# EAGLE design nanonode-xmega (EAGLE 5.10)
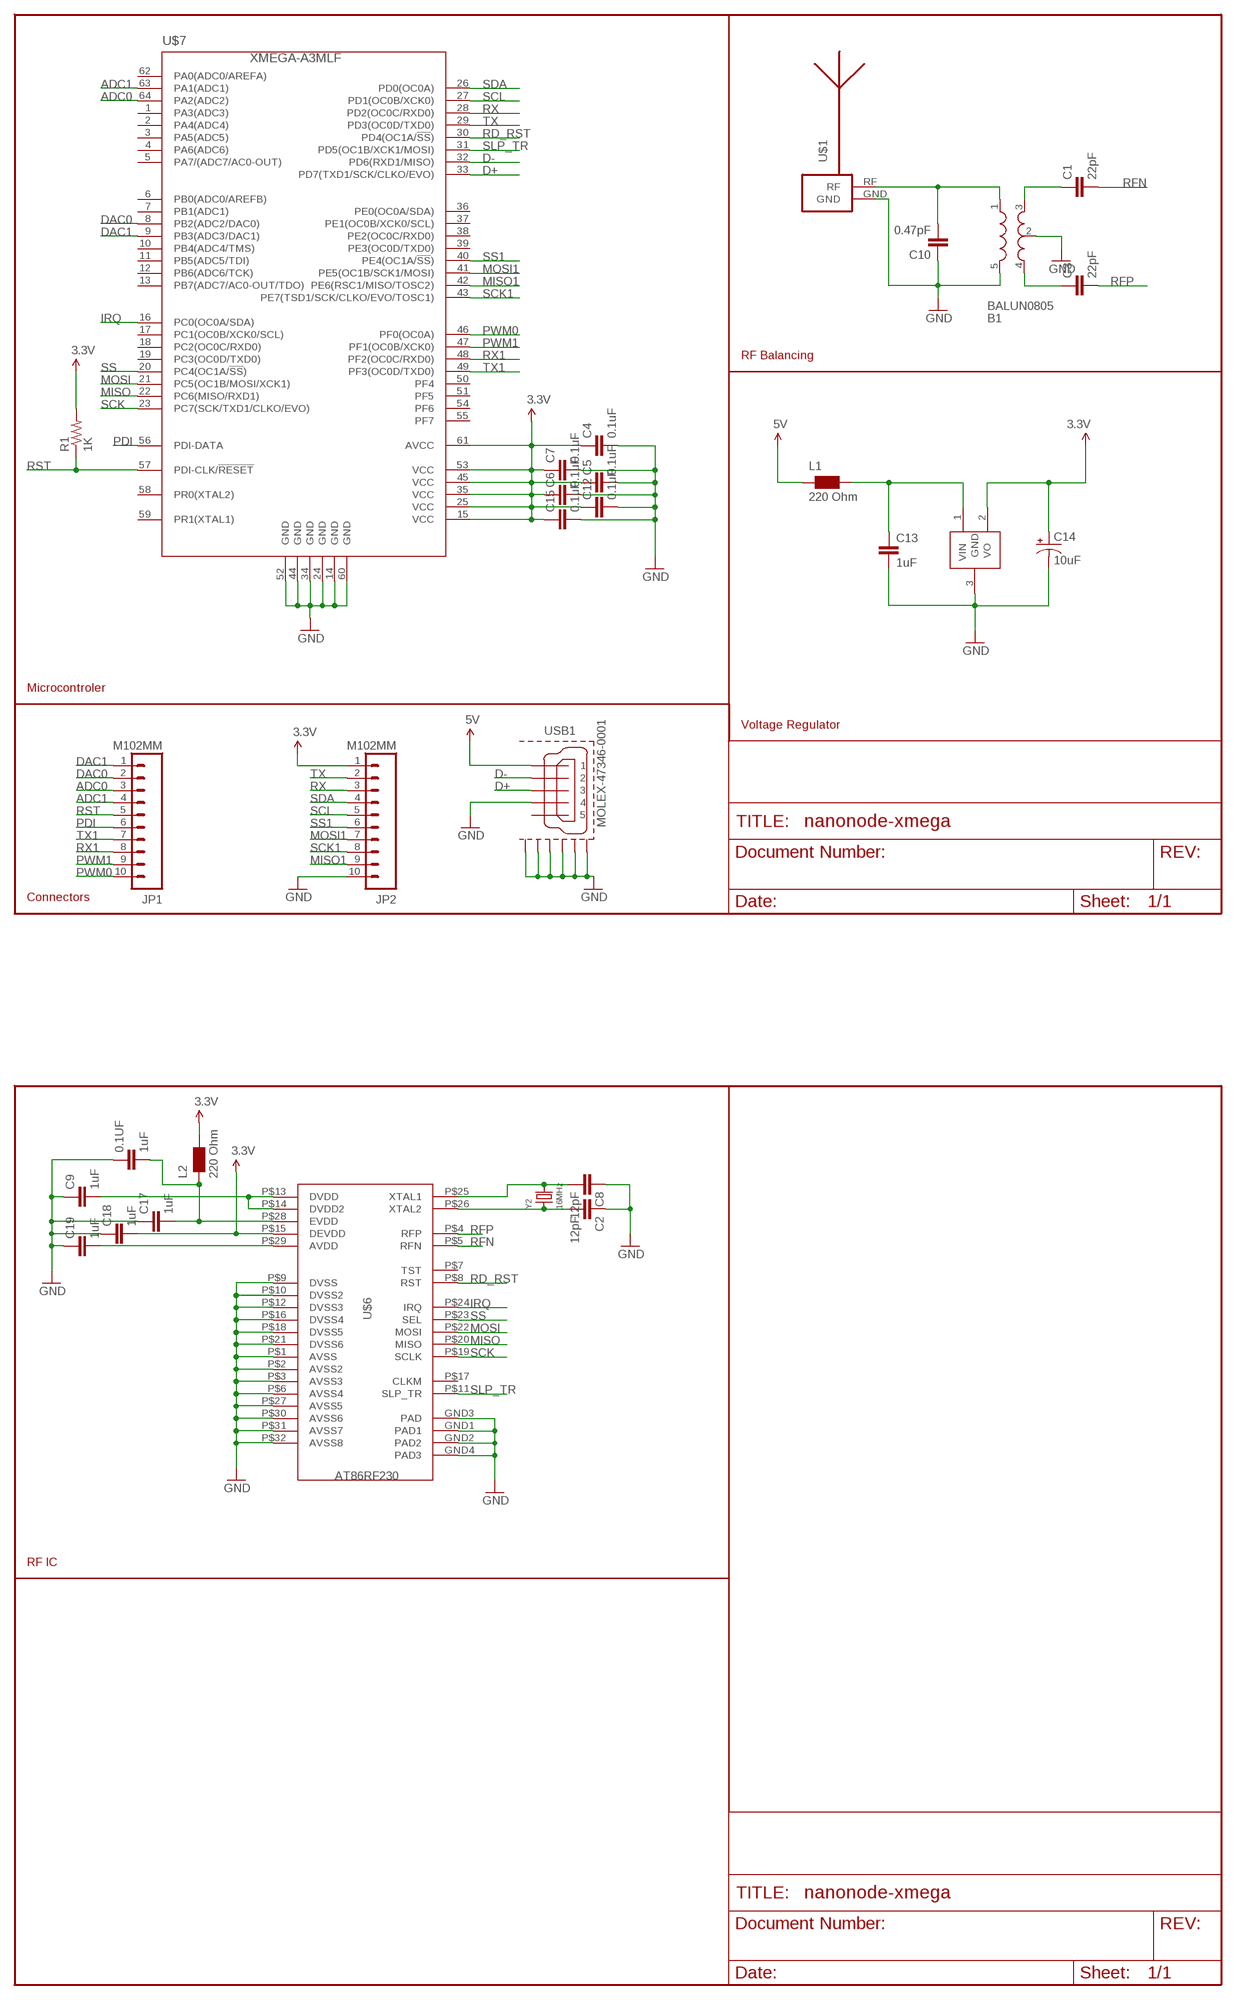
[diagram p0: schematic, sheet 1]

## Parts
0.1UF  1uF  C-EUC0603  [C0603]
B1  BALUN0805  [BALUN]
C1  22pF  C-EUC0603  [C0603]
C2  12pF  C-EUC0603  [C0603]
C3  22pF  C-EUC0603  [C0603]
C4  0.1uF  C-EUC0603  [C0603]
C5  0.1uF  C-EUC0603  [C0603]
C6  0.1uF  C-EUC0603  [C0603]
C7  0.1uF  C-EUC0603  [C0603]
C8  12pF  C-EUC0603  [C0603]
C9  1uF  C-EUC0603  [C0603]
C10  0.47pF  C-EUC0603  [C0603]
C12  0.1uF  C-EUC0603  [C0603]
C13  1uF  C-EUC0603  [C0603]
C14  10uF  CAP_POL1206  [EIA3216]
C15  0.1uF  C-EUC0603  [C0603]
C17  1uF  C-EUC0603  [C0603]
C18  1uF  C-EUC0603  [C0603]
C19  1uF  C-EUC0603  [C0603]
JP1  M102MM  [1X10-2MM]
JP2  M102MM  [1X10-2MM]
L1  220 Ohm  WE-CBF_0603  [0603]
L2  220 Ohm  WE-CBF_0603  [0603]
R1  1K  R-US_R0402  [R0402]
U$1  ANTENNA_1LEFT  [SWRA117D_LEFT]
U$4  MCP1700  [SOT23-3]
U$6  AT86RF230  [QFN-32]
U$7  XMEGA-A3MLF  [MLF64]
USB1  MOLEX-47346-0001  [MOLEX-47364-0001]
Y2  16MHz  CRYSTALTHIN  [CRYSTAL_3.2X2.5]

## Nets
3.3V: C4.1 C5.1 C6.1 C7.1 C12.1 C14.A(+) C15.1 C18.2 JP2.1 L2.2 R1.2 U$4.2(VO) U$6.P$15(DEVDD) U$7.15(VCC) U$7.25(VCC) U$7.35(VCC) U$7.45(VCC) U$7.53(VCC) U$7.61(AVCC)
5V: L1.1 USB1.1
ADC0: JP1.3 U$7.64(PA2(ADC2))
ADC1: JP1.4 U$7.63(PA1(ADC1))
D+: U$7.33(PD7(TXD1/SCK/CLKO/EVO)) USB1.3
D-: U$7.32(PD6(RXD1/MISO)) USB1.2
DAC0: JP1.2 U$7.8(PB2(ADC2/DAC0))
DAC1: JP1.1 U$7.9(PB3(ADC3/DAC1))
GND: 0.1UF.1 B1.2(GND) B1.5(GND) C2.1 C4.2 C5.2 C6.2 C7.2 C8.1 C9.1 C10.1 C12.2 C13.2 C14.C(-) C15.2 C17.1 C18.1 C19.1 JP2.10 U$1.GND U$4.3(GND) U$6.GND1(PAD1) U$6.GND2(PAD2) U$6.GND3(PAD) U$6.GND4(PAD3) U$6.P$1(AVSS) U$6.P$2(AVSS2) U$6.P$3(AVSS3) U$6.P$6(AVSS4) U$6.P$9(DVSS) U$6.P$10(DVSS2) U$6.P$12(DVSS3) U$6.P$16(DVSS4) U$6.P$18(DVSS5) U$6.P$21(DVSS6) U$6.P$27(AVSS5) U$6.P$30(AVSS6) U$6.P$31(AVSS7) U$6.P$32(AVSS8) U$7.14(GND) U$7.24(GND) U$7.34(GND) U$7.44(GND) U$7.52(GND) U$7.60(GND) USB1.4 USB1.GND1 USB1.GND2 USB1.GND3 USB1.GND4 USB1.GND5 USB1.GND6
IRQ: U$6.P$24(IRQ) U$7.16(PC0(OC0A/SDA))
MISO: U$6.P$20(MISO) U$7.22(PC6(MISO/RXD1))
MISO1: JP2.9 U$7.42(PE6(RSC1/MISO/TOSC2))
MOSI: U$6.P$22(MOSI) U$7.21(PC5(OC1B/MOSI/XCK1))
MOSI1: JP2.7 U$7.41(PE5(OC1B/SCK1/MOSI))
N$1: B1.3(OUT1) C1.1
N$2: B1.4(OUT2) C3.1
N$3: C2.2 U$6.P$26(XTAL2) Y2.1
N$4: C8.2 U$6.P$25(XTAL1) Y2.2
N$6: C9.2 U$6.P$13(DVDD) U$6.P$14(DVDD2)
N$8: C19.2 U$6.P$29(AVDD)
N$10: B1.1(IN) C10.2 U$1.RF
N$13: C13.1 L1.2 U$4.1(VIN)
N$15: 0.1UF.2 C17.2 L2.1 U$6.P$28(EVDD)
PDI: JP1.6 U$7.56(PDI-DATA)
PWM0: JP1.10 U$7.46(PF0(OC0A))
PWM1: JP1.9 U$7.47(PF1(OC0B/XCK0))
RD_RST: U$6.P$8(RST) U$7.30(PD4(OC1A/!SS!))
RFN: C1.2 U$6.P$5(RFN)
RFP: C3.2 U$6.P$4(RFP)
RST: JP1.5 R1.1 U$7.57(PDI-CLK/!RESET)
RX: JP2.3 U$7.28(PD2(OC0C/RXD0))
RX1: JP1.8 U$7.48(PF2(OC0C/RXD0))
SCK: U$6.P$19(SCLK) U$7.23(PC7(SCK/TXD1/CLKO/EVO))
SCK1: JP2.8 U$7.43(PE7(TSD1/SCK/CLKO/EVO/TOSC1))
SCL: JP2.5 U$7.27(PD1(OC0B/XCK0))
SDA: JP2.4 U$7.26(PD0(OC0A))
SLP_TR: U$6.P$11(SLP_TR) U$7.31(PD5(OC1B/XCK1/MOSI))
SS: U$6.P$23(SEL) U$7.20(PC4(OC1A/!SS!))
SS1: JP2.6 U$7.40(PE4(OC1A/!SS!))
TX: JP2.2 U$7.29(PD3(OC0D/TXD0))
TX1: JP1.7 U$7.49(PF3(OC0D/TXD0))
Unconnected: U$6.P$7(TST) U$6.P$17(CLKM) U$7.1(PA3(ADC3)) U$7.2(PA4(ADC4)) U$7.3(PA5(ADC5)) U$7.4(PA6(ADC6)) U$7.5(PA7/(ADC7/AC0-OUT)) U$7.6(PB0(ADC0/AREFB)) U$7.7(PB1(ADC1)) U$7.10(PB4(ADC4/TMS)) U$7.11(PB5(ADC5/TDI)) U$7.12(PB6(ADC6/TCK)) U$7.13(PB7(ADC7/AC0-OUT/TDO)) U$7.17(PC1(OC0B/XCK0/SCL)) U$7.18(PC2(OC0C/RXD0)) U$7.19(PC3(OC0D/TXD0)) U$7.36(PE0(OC0A/SDA)) U$7.37(PE1(OC0B/XCK0/SCL)) U$7.38(PE2(OC0C/RXD0)) U$7.39(PE3(OC0D/TXD0)) U$7.50(PF4) U$7.51(PF5) U$7.54(PF6) U$7.55(PF7) U$7.58(PR0(XTAL2)) U$7.59(PR1(XTAL1)) U$7.62(PA0(ADC0/AREFA)) USB1.5

## Notes on the sheet
- RF Balancing
- Microcontroler
- Voltage Regulator
- Connectors
- RF IC

## Library data of the parts
0.1UF C1-C10 C12 C13 C15 C17-C19 = rcl:C-EU: CAPACITOR, European symbol
B1 = custom:BALUN
C14 = sparkfun:CAP_POL: Capacitor Polarized These are standard SMD and PTH capacitors. Normally 10uF, 47uF, and 100uF in electrolytic and tantalum varieties. Always verify the external diameter of the through hole cap, it varies with capacity, voltage, and manufacturer. The EIA devices should be standard.
JP1 JP2 = sparkfun:M10: Header 10 Standard 10-pin 0.1" header. Use with straight break away headers (SKU : PRT-00116), right angle break away headers (PRT-00553), swiss pins (PRT-00743), machine pins (PRT-00117), and female headers (PRT-00115).
L1 L2 = wuerth-elektronik:WE-CBF: SMD EMI Suppression Ferrite Beads - excellent anti-EMI properties - low DCR - impedances till 3000 ohms - rated current up to 6 A
R1 = resistor:R-US_: RESISTOR, American symbol
U$1 = ant-planar-1:ANTENNA_1
U$4 = nonolith:MCP1700: Voltage regulator
U$6 = custom:AT86RF230
U$7 = custom:XMEGA-A3: Atmel XMega A3 series processor
USB1 = custom:MOLEX-47346-0001: MICRO USB B, BOTTOM MOUNT
Y2 = nonolith:CRYSTAL: Crystals HC49UP - Surface Mount Crystal 4.0MHz 18pF +/-30ppm Surface Mount Crystal [Digikey: 535-9857-1-ND] 12.0 MHz Surface Mount Crystal [Digikey: 535-9869-6-ND] 25.0 MHz Surface Mount Crystal [Digikey: 535-9078-1-ND] 3.2 x 2.5mm - MEMs SMT Crystal 12.0 MHz 8pF 15ppm 3.2 x 2.5mm Crystal [Digikey: 644-1047-1-ND] 16.0 MHz 8pF 15ppm 3.2 x 2.5mm Crystal [Digikey: 644-1049-1-ND] 16.0 MHz 10pF 10ppm 3.2 x 2.5mm Crystal [Digikey: 644-1100-1-ND] 27.12 MHz 18pF 30ppm 3.2 x 2.5mm Crystal [Digikey: 887-1424-1-ND] 4.9 x 1.8mm - MEMs SMT Crystal 32.768 KHz 12.5pF 20ppm 4.9 x 1.8mm Crystal [Digikey: SE2415CT-ND] Cylinder 32.768KHz Cylinder Crystal

## Board
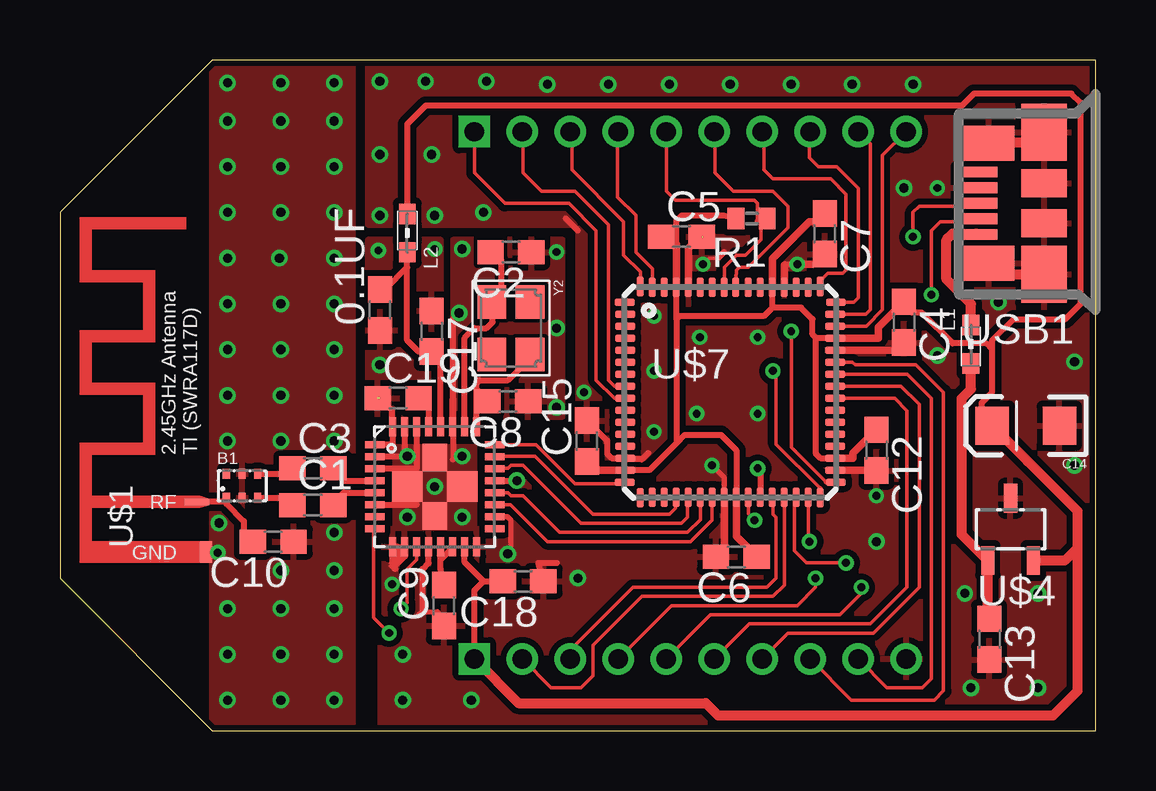
[diagram p1: board, top side]
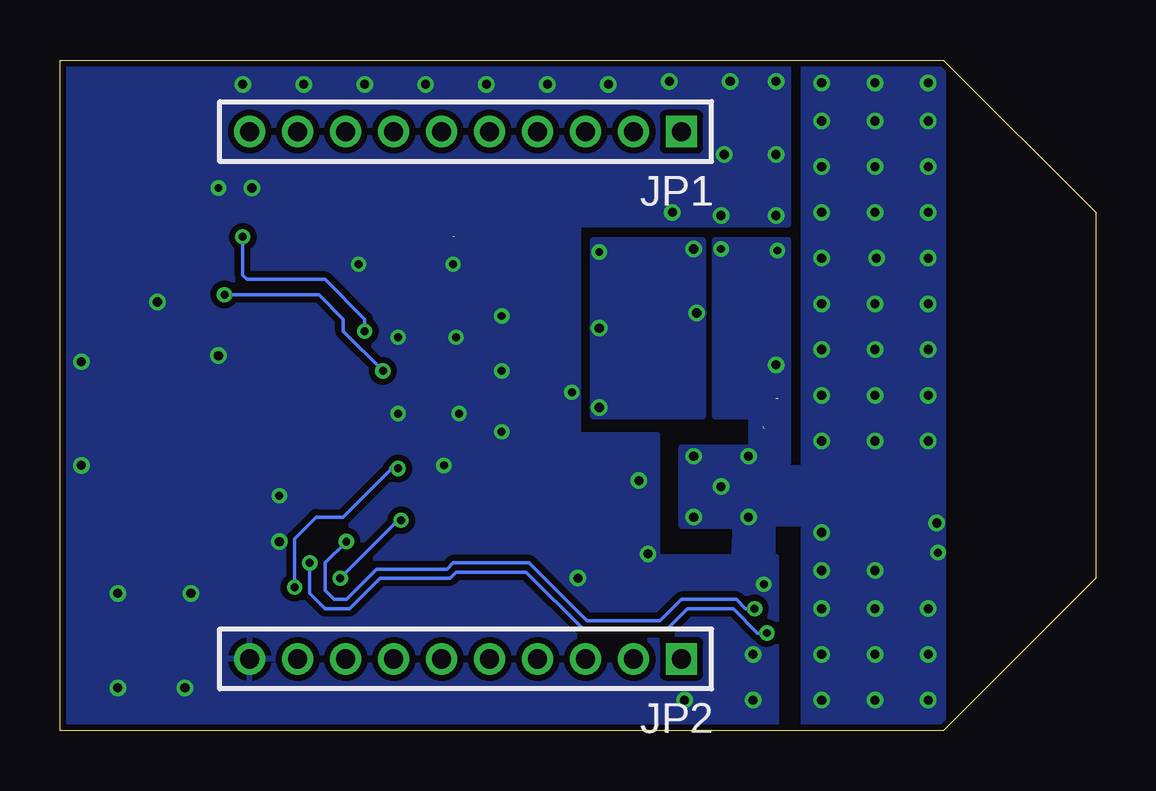
[diagram p2: board, bottom side, seen from below]

Size 43.18 x 27.94 mm. Coordinates in mm from the lower left corner, seen from the top.
Outline: 43.18,27.94 6.35,27.94 0,21.59 0,6.35 6.35,0 43.18,0 43.18,27.94
Copper layers (1*16): Top 0.035mm / dielectric 1.5mm / Bottom 0.035mm
Design rules "Fusion_eagle_rule_v1.1": minimum track width 6mil, minimum drill 12mil, track to track 6mil, track to pad 6mil, pad to pad 6mil, via to via 6mil, smd to smd 0mil, copper to edge 10mil, drill to drill 10mil, minimum pad ring 10mil, minimum via ring 6mil, stop-mask expansion 2mil, vias tented up to drill 100mil, thermal gap 10mil

### Footprints (pad centres in the part's own frame; a part is rotated, then mirrored left to right if it is on the bottom)
C0603 = smd 1.1 x 1: 1 -0.85,0; 2 0.85,0
BALUN = smd 0.3 x 0.4: 1 -0.7,-0.5; 2 -0.05,-0.5; 3 0.6,-0.5; 4 0.6,0.5; 5 -0.05,0.5; 6 -0.7,0.5
EIA3216 = smd 1.4 x 1.6: A 1.4,0; C -1.4,0
1X10-2MM = drill 0.8 square: 1 0,0 | drill 0.8 round: 2 2,0; 3 4,0; 4 6,0; 5 8,0; 6 10,0; 7 12,0; 8 14,0; 9 16,0; 10 18,0
0603 = smd 0.85 x 0.7: 1 -0.9,0; 2 0.7,0
R0402 = smd 0.7 x 0.9: 1 -0.65,0; 2 0.65,0
SWRA117D_LEFT = smd 0.9 x 0.508: GND 0.45,0.127 | smd 0.254 x 1.016: RF 2.54,0.51
SOT23-3 = smd 0.55 x 1.2: 1 0.95,1.3; 2 -0.95,1.3; 3 0,-1.3
QFN-32 = smd 1.27 x 1.27: GND1 0,1.143; GND3 0,-1.143 | smd 1.143 x 1.016: GND2 1.219,0; GND4 -1.219,0 | smd 0.285 x 0.8: P$1 -1.75,-2.5; P$2 -1.25,-2.5; P$3 -0.75,-2.5; P$4 -0.25,-2.5; P$5 0.25,-2.5; P$6 0.75,-2.5; P$7 1.25,-2.5; P$8 1.75,-2.5; P$17 1.75,2.5; P$18 1.25,2.5; P$19 0.75,2.5; P$20 0.25,2.5; P$21 -0.25,2.5; P$22 -0.75,2.5; P$23 -1.25,2.5; P$24 -1.75,2.5 | smd 0.8 x 0.285: P$9 2.5,-1.75; P$10 2.5,-1.25; P$11 2.5,-0.75; P$12 2.5,-0.25; P$13 2.5,0.25; P$14 2.5,0.75; P$15 2.5,1.25; P$16 2.5,1.75; P$25 -2.5,1.75; P$26 -2.5,1.25; P$27 -2.5,0.75; P$28 -2.5,0.25; P$29 -2.5,-0.25; P$30 -2.5,-0.75; P$31 -2.5,-1.25; P$32 -2.5,-1.75
MLF64 = smd 0.827 x 0.3: 1 -4.401,3.75; 2 -4.376,3.25; 3 -4.376,2.75; 4 -4.376,2.25; 5 -4.376,1.75; 6 -4.376,1.25; 7 -4.376,0.75; 8 -4.376,0.25; 9 -4.376,-0.25; 10 -4.376,-0.75; 11 -4.376,-1.25; 12 -4.376,-1.75; 13 -4.376,-2.25; 14 -4.376,-2.75; 15 -4.376,-3.25; 16 -4.401,-3.75; 33 4.401,-3.75; 34 4.376,-3.25; 35 4.376,-2.75; 36 4.376,-2.25; 37 4.376,-1.75; 38 4.376,-1.25; 39 4.376,-0.75; 40 4.376,-0.25; 41 4.376,0.25; 42 4.376,0.75; 43 4.376,1.25; 44 4.376,1.75; 45 4.376,2.25; 46 4.376,2.75; 47 4.376,3.25; 48 4.401,3.75 | smd 0.3 x 0.827: 17 -3.75,-4.401; 18 -3.25,-4.376; 19 -2.75,-4.376; 20 -2.25,-4.376; 21 -1.75,-4.376; 22 -1.25,-4.376; 23 -0.75,-4.376; 24 -0.25,-4.376; 25 0.25,-4.376; 26 0.75,-4.376; 27 1.25,-4.376; 28 1.75,-4.376; 29 2.25,-4.376; 30 2.75,-4.376; 31 3.25,-4.376; 32 3.75,-4.401; 49 3.75,4.401; 50 3.25,4.376; 51 2.75,4.376; 52 2.25,4.376; 53 1.75,4.376; 54 1.25,4.376; 55 0.75,4.376; 56 0.225,4.376; 57 -0.25,4.376; 58 -0.75,4.376; 59 -1.25,4.376; 60 -1.75,4.376; 61 -2.25,4.376; 62 -2.75,4.376; 63 -3.25,4.376; 64 -3.75,4.401
MOLEX-47364-0001 = smd 1.7 x 0.45: 1 2.8,1.3; 2 2.8,0.65; 3 2.8,0; 4 2.8,-0.65; 5 2.8,-1.3 | smd 1.9 x 2.375: GND1 0,2.95; GND4 0,-2.95 | smd 2.1 x 1.475: GND2 2.3,2.5; GND3 2.3,-2.5 | smd 1.9 x 1.175: GND5 0,-0.838; GND6 0,0.838
CRYSTAL_3.2X2.5 = smd 1.4 x 1.2: 1 -1.1,-0.8; 2 1.1,0.8; GND1 -1.1,0.8; GND2 1.1,-0.8

### Placement (x,y rotation side)
0.1UF  13.34,17.53 90 top
B1  7.64,10.2 0 top
C1  10.54,9.4 0 top
C2  18.8,19.94 180 top
C3  10.54,10.92 0 top
C4  35.18,17.02 270 top
C5  25.91,20.57 0 top
C6  28.19,7.24 180 top
C7  31.88,20.7 270 top
C8  18.67,13.72 180 top
C9  16,5.21 90 top
C10  8.89,7.87 180 top
C12  34.04,11.68 270 top
C13  38.73,3.81 270 top
C14  40.26,12.7 180 top
C15  21.97,12.06 90 top
C17  15.49,16.64 270 top
C18  19.3,6.22 180 top
C19  14.1,13.84 0 top
JP1  17.27,24.96 180 bottom
JP2  17.27,2.98 180 bottom
L1  37.97,16 270 top
L2  14.48,20.83 90 top
R1  28.83,21.34 180 top
U$1  6.22,6.99 90 top
U$4  39.62,8.38 180 top
U$6  15.62,10.16 270 top
U$7  27.94,14.1 0 top
USB1  41.02,21.97 180 top
Y2  18.8,16.76 270 top

### Tracks (layer width: path | path; a pad name or v marks a point on that pad's centre or on a via)
3.3V
  Top 0.254: 22.54,10.85 C15.1 | U$7.15 24.56,10.85 25.69,11.97 | U$7.25 28.19,9.78 28.19,11.68 27.56,12.32 26.04,12.32 25.69,11.97 | 25.69,17.14 25.69,11.97 | 25.69,17.14 U$7.61 | 29.69,17.62 U$7.53 | 29.69,17.62 29.34,17.27 25.82,17.27 25.69,17.14 | 29.69,17.62 30.89,17.62 31.37,17.14 31.37,16.51 31.53,16.35 | U$7.45 31.53,16.35 | C5.1 25.69,20.27 25.69,21.25 25.91,21.46 27.67,21.46 R1.2 | JP2.1 17.27,5.84 17.65,6.22 | 17.65,6.22 C18.2 | L2.2 14.48,25.27 15.24,26.04 37.59,26.04 38.1,26.54 42.16,26.54 42.55,26.16 42.55,17.78 41.91,17.14 39.75,17.14 38.86,16.26 38.86,15.88 | 38.42,12.39 38.42,13.65 38.86,14.1 38.86,15.88 | 38.86,15.88 38.61,16.13 37.21,16.13 35.93,17.41 35.51,17.41 C4.1 | U$7.35 31.71,11.35 31.5,11.56 31.5,16.31 31.53,16.35 | U$6.P$15 16.87,7 17.65,6.22
  Top 0.305: U$7.15 22.54,10.85 | U$7.35 33.05,11.35 33.05,11.55 C12.1 | U$7.45 34.11,16.35 34.11,16.8 C4.1 | U$7.61 25.69,20.27 | U$7.25 28.19,8.09 C6.1 | U$7.53 29.69,19.66 31.24,21.21 31.54,21.21 C7.1
  Top 0.406: 38.42,12.39 C14.A 40.34,11.22 40.35,11.22 42.42,9.14 42.42,7.62 | JP2.1 19.11,1.14 26.92,1.14 27.43,0.64 41.4,0.64 42.42,1.65 42.42,7.62 | U$4.2 41.88,7.08 42.42,7.62
5V
  Top 0.406: L1.1 37.97,17.78 36.96,18.8 36.96,20.45 37.21,20.7 38.19,20.7 USB1.1
ADC0
  Top 0.152: JP1.3 21.34,24.89 21.34,23.37 23.5,21.21 23.5,19.81 24.19,19.12 U$7.64
ADC1
  Top 0.152: JP1.4 23.24,24.92 23.24,22.23 24,21.46 24,19.94 24.69,19.25 U$7.63
D+  (via drill 0.33)
  Top 0.152: v35.56,20.57 35.56,21.59 35.81,21.84 38.09,21.84 USB1.3 | 31.94,10.35 30.48,11.81 v30.48,16.64
  Top 0.203: U$7.33 31.94,10.35
  Bottom 0.152: v30.48,16.64 30.48,17.14 32.13,18.8 35.38,18.8 35.56,18.97 v35.56,20.57
D-  (via drill 0.33)
  Top 0.152: 31.69,10.09 29.84,11.94 29.84,14.86 v29.72,14.99 | v36.32,18.16 36.32,20.83 36.7,21.21 38.11,21.21 USB1.2
  Top 0.203: U$7.32 31.69,10.09
  Bottom 0.152: v36.32,18.16 32.38,18.16 31.37,17.14 31.37,16.64 v29.72,14.99
DAC0
  Top 0.152: U$7.8 23.12,14.35 22.86,14.61 22.86,21.08 21.46,22.48 20.07,22.48 19.3,23.24 19.3,24.92 JP1.2
DAC1
  Top 0.152: JP1.1 17.27,23.24 18.54,21.97 21.21,21.97 22.35,20.83 22.35,14.61 23.11,13.85 U$7.9
GND  (via drill 0.33, 0.38)  (3 unrouted)
  Top 0.152: 27.43,19.68 27.05,19.68 v26.8,19.43
  Top 0.203: U$7.24 27.69,10.54 v27.18,11.05 | U$6.P$18 18.65,8.91 18.8,8.76 18.8,7.49 | 15.11,4.95 15.73,4.95 C9.1
  Top 0.254: U$6.P$27 16.37,13.83 16.38,13.84 | 16.38,13.84 16.38,17.14 v16.64,17.4 | C6.2 27.69,7.64 | 33.85,10.85 C12.2 | 23.34,11.35 U$7.14 22.99,11.35 22.81,11.53 22.81,12.08 C15.2 | 34.91,15.85 C4.2 | 31.38,19.43 C7.2 | 26.67,20.57 26.8,20.57 | 21.08,21.34 21.59,20.83 | 14.35,7.64 U$6.P$10 14.37,7.26 13.97,6.86 | 13.84,6.99 13.87,7.01 U$6.P$9 14.06,7.66 14.1,7.62 13.84,7.62 | 13.84,6.99 13.84,6.86 13.97,6.73 | U$6.P$6 14.87,9.41 | U$6.P$3 14.87,10.91 U$6.P$30 | U$6.P$2 14.37,11.41 U$6.P$31 | U$6.P$32 13.87,11.76 13.72,11.91 U$6.P$1 | 16.38,13.84 16.38,11.3 | v18.67,7.37 18.8,7.49 | C18.1 19.95,6.97 19.94,6.99 20.7,6.99 | U$6.P$12 15.37,6.99 15.11,6.73 15.11,4.95 14.99,4.83 | 13.84,7.62 13.84,6.99 | 13.84,7.62 13.84,7.87 | v19.05,10.41 U$6.P$21 | 27.43,19.68 27.69,19.94 | 13.84,12.57 13.84,13.34 13.34,13.84 | 30.19,19.39 30.23,19.43 v30.73,19.43 | 23.62,11.3 24.26,11.3 24.51,11.56
  Top 0.305: 27.69,7.64 U$7.24 | U$7.34 33.85,10.85 | U$7.44 34.91,15.85 | v30.73,19.43 31.38,19.43 | U$7.60 26.19,20.09 26.67,20.57 | 14.1,7.11 14.1,7.62 | U$7.52 30.19,19.39
  Top 0.406: USB1.GND1 39.17,19.02 USB1.GND2 | 38.73,24.51 41.02,24.51
  other vias: 6.99,12.06 9.21,12.06 6.63,8.65 11.43,6.67 9.21,6.67 16.76,20.07 20.7,19.94 20.7,16.76 20.7,13.46 26.67,16.38 34.04,9.78 36.58,15.62 24.77,12.45 42.29,11.05 34.04,7.87 26.54,13.21 29.08,13.21 29.08,16.38 24.77,14.99 24.77,17.27 21.84,14.1 13.34,24 40.77,5.71 35.18,22.61 35.56,26.92 33.02,26.92 30.48,26.92 27.94,26.92 25.4,26.92 22.86,26.92 20.32,26.92 17.78,27.05 15.24,27.05 13.34,27.05 11.43,8.26 13.34,21.46 11.43,12.06 6.58,7.42 6.99,19.68 9.14,19.68 11.43,19.68 6.99,17.78 9.21,17.78 11.43,17.78 6.99,15.88 9.21,15.88 11.43,15.88 6.99,13.97 9.21,13.97 11.43,13.97 15.49,24 15.62,21.46 17.65,21.59 6.99,26.99 9.21,26.99 11.43,26.99 11.43,25.4 11.43,23.5 9.21,23.5 6.99,23.5 6.99,25.4 9.21,25.4 6.99,21.59 9.21,21.59 11.43,21.59 6.99,5.08 6.99,3.17 6.99,1.27 9.21,5.08 9.21,3.17 9.21,1.27 11.43,5.08 11.43,3.17 11.43,1.27 21.59,6.35 14.29,3.17 14.29,1.27 17.14,1.27 13.27,20 15.62,20.07 37.72,5.71 37.97,1.78 40.77,1.78 13.84,6.1 36.58,22.61 42.29,15.37 39.12,17.86 15.62,10.16 14.48,11.43 16.76,11.43 16.76,8.89 14.48,8.89 13.34,15.24
  pour Top (isolate 0.254): 12.19,27.81 12.19,0.25 6.35,0.25 6.35,27.81
  pour Top: 20.95,20.45 16.38,20.45 16.38,13.08 20.95,13.08
  pour Top (isolate 0.254): 43.18,27.94 12.83,27.94 12.83,21.08 21.59,21.08 21.59,12.45 17.91,12.45 17.91,8.38 13.34,8.38 13.34,5.84 13.34,0.13 43.18,0.13
  pour Top (isolate 0.254): 15.88,20.45 12.83,20.45 12.83,13.21 15.88,13.21
  pour Bottom (isolate 0.254): 6.35,27.81 12.19,27.81 12.19,10.92 14.22,10.92 14.22,8.64 12.19,8.64 12.19,0.25 6.35,0.25
  pour Bottom (isolate 0.254): 17.27,11.81 13.97,11.81 13.97,8.51 17.27,8.51
  pour Bottom (isolate 0.254): 15.88,20.45 12.83,20.45 12.83,11.18 14.35,11.18 14.35,13.08 15.88,13.08
  pour Bottom (isolate 0.254): 43.05,27.81 12.83,27.81 12.83,21.08 21.59,21.08 21.59,12.32 18.29,12.32 18.29,7.24 13.34,7.24 13.34,5.84 13.34,0.13 43.05,0.13
  pour Bottom (isolate 0.254): 20.95,20.45 16.38,20.45 16.38,13.08 20.95,13.08
  pour Bottom: 14.99,9.53 13.46,9.53 13.46,6.99 15.11,6.99
  pour Top (isolate 0.203): 17.27,11.81 13.97,11.81 13.97,8.51 17.27,8.51
IRQ
  Top 0.152: U$6.P$24 19.84,11.91 21.46,10.29 23.55,10.29 U$7.16
MISO
  Top 0.152: U$7.22 26.69,8.78 26.16,8.26 20.83,8.26 19.3,9.78 18.8,9.78 18.67,9.91 U$6.P$20
  Top 0.254: U$6.P$20
MISO1
  Top 0.152: U$7.42 35.32,14.85 36.32,13.84 36.32,2.16 35.94,1.78 34.48,1.78 JP2.9
MOSI
  Top 0.152: 18.13,10.92 18.67,10.92 18.8,11.05 19.3,11.05 21.72,8.64 25.91,8.64 26.16,8.89 26.16,9.74
  Top 0.254: 26.16,9.74 U$7.21 | U$6.P$22 18.13,10.92
MOSI1
  Top 0.152: U$7.41 35.06,14.35 35.81,13.59 35.81,5.97 33.91,4.06 30.35,4.06 JP2.7
N$1
  Top 0.254: B1.3 9.39,9.7 C1.1
N$2
  Top 0.254: B1.4 9.47,10.7 C3.1
N$3
  Top 0.254: U$6.P$26 16.87,16.36 17.27,16.76 17.78,16.76 18.03,17.02 18.03,17.83 Y2.1 18.4,18.27 18.4,19.61 C2.2
N$4
  Top 0.254: U$6.P$25 17.37,14.22 | 17.37,14.22 17.37,14.48 | 17.37,14.48 17.37,14.58 17.4,14.61 | C8.2 17.62,13.97 17.37,14.22 | Y2.2 19.6,15.53 18.67,14.61 17.5,14.61 17.37,14.48
N$6
  Top 0.254: 15.87,7.11 U$6.P$13 | U$6.P$14 16.37,7.61 15.87,7.11 | 15.87,7.11 15.87,6.74 C9.2
N$8
  Top 0.254: U$6.P$29 15.37,13.47 C19.2
N$10
  Top 0.254: U$1.RF 5.72,9.53 6.86,9.53 6.94,9.61 B1.1 6.94,9.45 7.66,8.72 7.66,8.26 C10.2
N$13
  Top 0.406: L1.2 37.97,14.22 37.59,13.84 37.59,8.16 U$4.1 38.67,4.72 C13.1
N$15
  Top 0.254: U$6.P$28 15.87,15.41 C17.2 14.95,15.79 14.48,16.26 14.48,19.3 | 14.48,19.3 L2.1 | 0.1UF.2 13.55,18.38 14.48,19.3
PDI
  Top 0.152: U$7.56 28.19,19.17 28.32,19.3 28.7,19.3 30.35,20.95 30.35,21.84 29.72,22.48 28.07,22.48 27.3,23.24 27.3,24.92 JP1.6
PWM0
  Top 0.152: JP1.10 34.29,23.97 34.29,17.53 33.61,16.85 U$7.46
PWM1
  Top 0.152: U$7.47 33.6,17.35 33.78,17.53 33.78,24.45 JP1.9
RD_RST  (via drill 0.33)
  Top 0.152: U$7.30 30.61,9.64 30.61,7.49 31.11,6.99 v32.77,6.99 | v13.72,4.06 13.08,4.7 13.08,8.37 U$6.P$8
  Bottom 0.152: v13.72,4.06 14.1,4.06 15.11,5.08 17.02,5.08 17.91,4.19 21.34,4.19 23.75,6.6 26.67,6.6 26.92,6.35 29.84,6.35 31.11,5.08 32.13,5.08 32.77,5.71 v32.77,6.99
RFN
  Top 0.254: U$6.P$5 11.83,9.91 C1.2
RFP
  Top 0.254: U$6.P$4 11.83,10.41 C3.2
RST
  Top 0.152: U$7.57 27.69,19.31 28.19,19.81 28.57,19.81 29.21,20.45 29.21,21.22 | JP1.5 25.27,22.48 25.65,22.1 28.96,22.1 29.08,21.97 29.08,21.22
  Top 0.254: 29.21,21.22 R1.1 29.08,21.22 | JP1.5
RX
  Top 0.152: JP2.3 21.34,3.05 21.34,3.43 23.88,5.97 29.46,5.97 29.84,6.35 29.84,8.89 29.72,9.02 29.72,9.69 U$7.28
RX1
  Top 0.152: U$7.48 33.09,17.85 33.27,18.03 33.27,22.61 32.38,23.5 31.62,23.5 31.24,23.88 31.24,24.93 JP1.8
SCK
  Top 0.152: 27.18,9.76 U$7.23 27.18,9.71 27.18,8.76 26.29,7.87 20.32,7.87 18.78,9.41 U$6.P$19
SCK1
  Top 0.152: JP2.8 32.99,1.27 36.45,1.27 36.83,1.65 36.83,14.1 35.69,15.24 33.15,15.24 33.04,15.35 U$7.43
SCL  (via drill 0.33)
  Top 0.152: v33.4,5.97 33.4,5.71 32.51,4.83 27.11,4.83 JP2.5
  Top 0.254: U$7.27 29.19,10.81 v29.08,10.92
  Bottom 0.152: 29.34,10.92 31.37,8.89 32.51,8.89 33.4,8 v33.4,5.97
  Bottom 0.254: 29.34,10.92 v29.08,10.92
SDA  (via drill 0.33)
  Top 0.152: U$7.26 28.69,9.03 v28.96,8.76 | v31.5,6.35 31.5,5.97 30.73,5.21 25.49,5.21 JP2.4
  Top 0.254: JP2.4 23.27,3.08
  Bottom 0.152: v31.5,6.35 29.08,8.76
  Bottom 0.254: 29.08,8.76 v28.96,8.76
SLP_TR  (via drill 0.33)
  Top 0.152: 31.19,7.93 U$7.31 | U$6.P$11 14.87,7.12 14.48,6.73 14.48,5.33 v14.22,5.08
  Top 0.254: v31.24,7.87 31.19,7.93
  Bottom 0.152: v14.22,5.08 14.61,5.08 14.99,5.46 17.27,5.46 18.16,4.57 21.21,4.57 23.62,6.99 26.8,6.99 27.05,6.73 29.97,6.73 31.24,5.46 31.75,5.46 32.13,5.84 32.13,6.99 v31.24,7.87
SS
  Top 0.152: 18.14,11.43 19.81,11.43 22.23,9.02 25.4,9.02 25.65,9.27 25.65,9.74
  Top 0.254: 25.65,9.74 U$7.20 | U$6.P$23 18.14,11.43
SS1
  Top 0.152: U$7.40 34.79,13.85 35.31,13.34 35.31,5.97 33.78,4.45 28.73,4.45 JP2.6
TX
  Top 0.152: JP2.2 20.48,1.78 21.72,1.78 22.23,2.29 22.23,3.56 24.26,5.59 29.72,5.59 30.19,6.06 U$7.29
TX1
  Top 0.152: U$7.49 31.69,18.74 32,19.05 32.64,19.05 32.77,19.18 32.77,22.35 32.13,22.99 29.72,22.99 29.34,23.37 29.34,24.89 JP1.7